# Altium schematic sheet QCopterCAM_LED_Sch.SchDoc
size A4
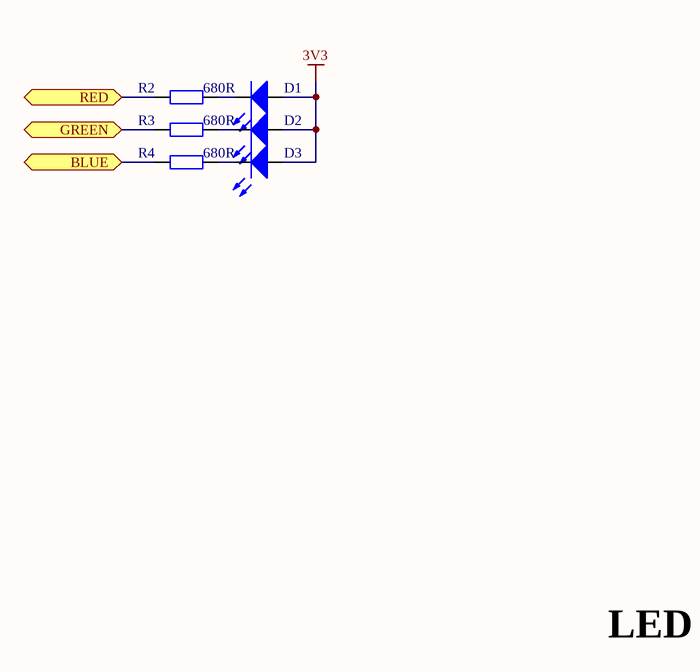
[diagram p0: QCopterCAM_LED_Sch.SchDoc]

## Parts
D1  LED_0603_RED  [LED_0603_RED]  (value not drawn)
D2  LED_0603_GREEN  [LED_0603_GREEN]  (value not drawn)
D3  LED_0603_BLUE  [LED_0603_BLUE]  (value not drawn)
R2  value 680R  [RES_0603]  (hidden comment: Res_0603)
R3  value 680R  [RES_0603]  (hidden comment: Res_0603)
R4  value 680R  [RES_0603]  (hidden comment: Res_0603)

## Ports
BLUE, GREEN, RED

## Nets
3V3: D1.1(A) D2.1(A) D3.1(A)
BLUE: R4.1 ; port BLUE
GREEN: R3.1 ; port GREEN
RED: R2.1 ; port RED
NetD1_2: D1.2(K) R2.2
NetD2_2: D2.2(K) R3.2
NetD3_2: D3.2(K) R4.2

## Notes on the sheet
- LED

## Library data of the parts
D1 = LED_0603_RED: LED
D2 = LED_0603_GREEN: LED
D3 = LED_0603_BLUE: LED
R2-R4 = Res_0603: Resistor